# Altium schematic sheet MPU6050_ledMatrix.SchDoc
size A4; SheetNumber: 3; SheetTotal: 4
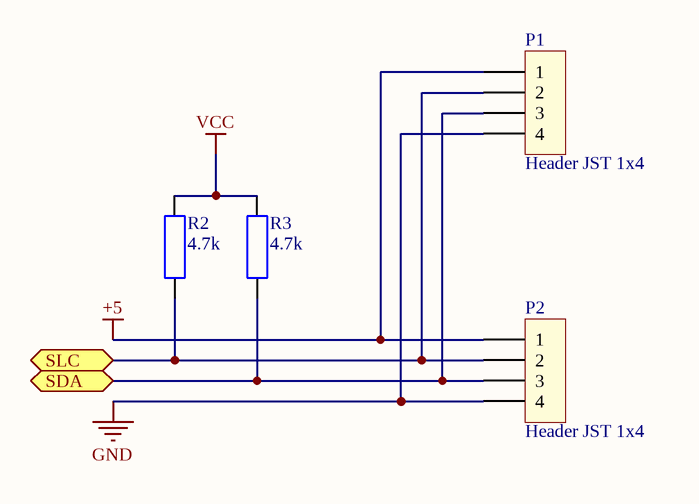
[diagram p0: MPU6050_ledMatrix.SchDoc]

## Parts
P1  Header JST 1x4  [THT_HEADER_78MIL_JST_1X4_MALE]
P2  Header JST 1x4  [THT_HEADER_78MIL_JST_1X4_MALE]
R2  4.7k  [SMD_RESISTOR_1206]
R3  4.7k  [SMD_RESISTOR_1206]

## Ports
SDA (bidir), SLC (bidir)

## Nets
+5: P1.1 P2.1
GND: P1.4 P2.4
VCC: R2.1 R3.1
SDA: P1.3 P2.3 R3.2 ; port SDA
SLC: P1.2 P2.2 R2.2 ; port SLC

## Library data of the parts
P1 P2 = Header_JST_1x4
R2 R3 = Resistor: 1206: http://cz.farnell.com/webapp/wcs/stores/servlet/Search?catalogId=15001&langId=420&storeId=10156&categoryId=700000005450&pageSize=100&showResults=true&sf=502,707&pf=1012211755; 0805: http://cz.farnell.com/webapp/wcs/stores/servlet/Search?catalogId=15001&langId=420&storeId=10156&categoryId=700000005450&sort=P_PRICE&pageSize=100&showResults=true&sf=502,707&pf=1012211743; Value: 4.7k